# Altium project Bees.PrjPcb
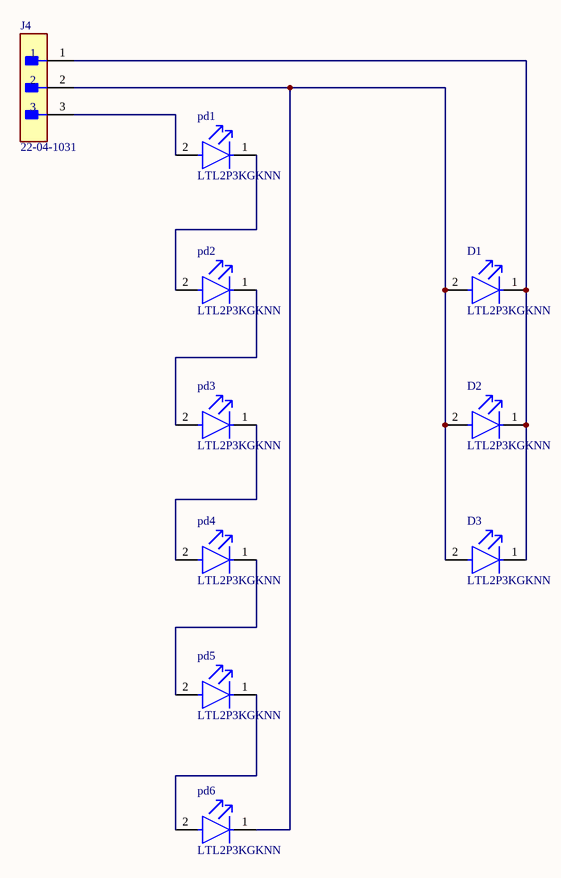
[diagram p0: ir.SchDoc]
3 sheets, 40 parts. Net scope: flat (ports and power ports of the same name join across sheets).
Board file: PCB2.PcbDoc
Sheets:
  ir.SchDoc
  atmega.SchDoc
  esp32.SchDoc

## Sheet ir.SchDoc
size A; SheetNumber: 1; SheetTotal: 2

### Parts
D1  LTL2P3KGKNN  [FP-LTL2P3KGKNN-MFG]
D2  LTL2P3KGKNN  [FP-LTL2P3KGKNN-MFG]
D3  LTL2P3KGKNN  [FP-LTL2P3KGKNN-MFG]
J4  22-04-1031  [FP-22-04-1031-MFG]
pd1  LTL2P3KGKNN  [FP-LTL2P3KGKNN-MFG]
pd2  LTL2P3KGKNN  [FP-LTL2P3KGKNN-MFG]
pd3  LTL2P3KGKNN  [FP-LTL2P3KGKNN-MFG]
pd4  LTL2P3KGKNN  [FP-LTL2P3KGKNN-MFG]
pd5  LTL2P3KGKNN  [FP-LTL2P3KGKNN-MFG]
pd6  LTL2P3KGKNN  [FP-LTL2P3KGKNN-MFG]

### Nets
NetD1_1: D1.1(C) D2.1(C) D3.1(C) J4.1
NetD1_2: D1.2(A) D2.2(A) D3.2(A) J4.2 pd6.1(C)
NetJ4_3: J4.3 pd1.2(A)
Netpd1_1: pd1.1(C) pd2.2(A)
Netpd2_1: pd2.1(C) pd3.2(A)
Netpd3_1: pd3.1(C) pd4.2(A)
Netpd4_1: pd4.1(C) pd5.2(A)
Netpd5_1: pd5.1(C) pd6.2(A)

### Library data of the parts
D1-D3 pd1-pd6 = CMP-22017-000002-1: LED GREEN CLEAR T-1 3/4 T/H; Manufacturer: Lite-On; Forward Voltage: 2.1V; Led Orientation: Straight; Forward Current: 20mA; Luminous Intensity: 980mcd; Wavelength: 572nm; Power Dissipation: 75mW; Peak Emmision Wavelength: 575nm; Viewing Angle: 22°; Reverse Voltage: 5V; Category: Diode; Temperature Range Low: -40°C; Device Class L1: Optoelectronics; Temperature: -40°C to +100°C; Mouser Description: LED Uni-Color Green 575nm 2-Pin T-1 3/4; Height: 9.95mm; Package: 0; Colour: Green; ComponentLink2Description: Datasheet; Digikey Description: LED GREEN CLEAR T-1 3/4 T/H; Automotive: No; Lead Free: Yes; ComponentLink2URL: https://optoelectronics.liteon.com/upload/download/DS20-2000-193/LTL2P3KGKNN.pdf; Manufacturer Part Number: LTL2P3KGKNN; Temperature Range High: +100°C; RoHS: TRUE; Device Class L2: LEDs; Device Class L3: unset; Octopart: https://octopart.com/ltl2p3kgknn-lite-on-550036
J4 = CMP-04776-000410-1: CONN HEADER VERT 3POS 2.5MM; Voltage Rating (AC): 250V; Number of Contacts: 3; Max Voltage Rating (DC): 250.25kV; Contact Resistance: 20mR; Hole Diameter: 1.19mm; Gender: Male; Connector Type: Male Pin; Insulation Resistance: 1GR; Glow Wire Compliant: Non-compliant; Current Rating: 3A; Contact Material: Brass; Series: KK; Number of Positions: 3; Contact Gender: Male; Mount: Through Hole; Working Voltage: 250V; Number of Poles: 3; Termination: Solder; Radiation Hardening: No; Lead Free: Lead Free; Min Operating Temperature: -40°C; Contact Mating Length: 0.295inch; Packaging: Bulk; Lead Pitch: 2.5mm; Voltage Rating: 250V; Voltage Rating (DC): 250V; Orientation: Straight; Color: Natural; Flammability Rating: UL94 V-0; Housing Material: Nylon; Pitch: 2.5mm; Contact Type: Male Pin; Number of Rows: 1; Housing Color: Natural; Max Operating Temperature: 105°C; Fastening Type: Friction; Halogen Free: Low Halogen; Contact Plating: Tin; Package Quantity: 1; Number of Circuits: 3

## Sheet atmega.SchDoc
size A; SheetNumber: 2; SheetTotal: 4
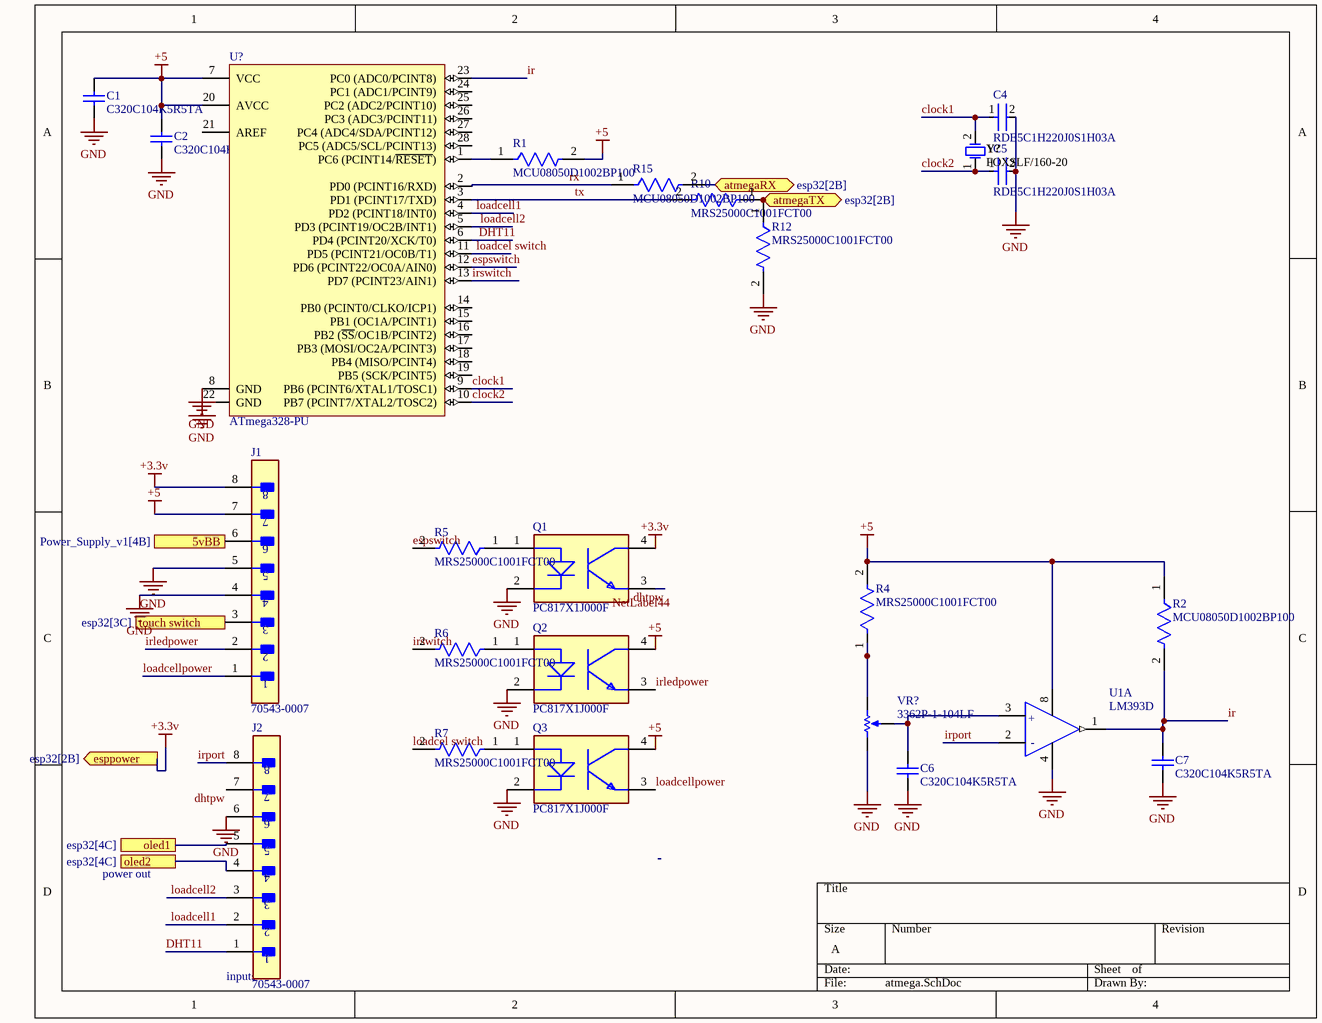
[diagram p1: atmega.SchDoc]

### Parts
C1  C320C104K5R5TA  [CAPR51-254-508X318X736]
C2  C320C104K5R5TA  [CAPR51-254-508X318X736]
C4  RDE5C1H220J0S1H03A  [FP-RDE0P1-MFG]
C5  RDE5C1H220J0S1H03A  [FP-RDE0P1-MFG]
C6  C320C104K5R5TA  [CAPR51-254-508X318X736]
C7  C320C104K5R5TA  [CAPR51-254-508X318X736]
J1  70543-0007  [FP-70543-0007-MFG]
J2  70543-0007  [FP-70543-0007-MFG]
Q1  PC817X1J000F  [FP-PC817X1J000F-MFG]
Q2  PC817X1J000F  [FP-PC817X1J000F-MFG]
Q3  PC817X1J000F  [FP-PC817X1J000F-MFG]
R1  MCU08050D1002BP100  [FP-MCU0805-IPC_C]
R2  MCU08050D1002BP100  [FP-MCU0805-IPC_C]
R4  MRS25000C1001FCT00  [FP-MRS25-MFG]
R5  MRS25000C1001FCT00  [FP-MRS25-MFG]
R6  MRS25000C1001FCT00  [FP-MRS25-MFG]
R7  MRS25000C1001FCT00  [FP-MRS25-MFG]
R10  MRS25000C1001FCT00  [FP-MRS25-MFG]
R12  MRS25000C1001FCT00  [FP-MRS25-MFG]
R15  MCU08050D1002BP100  [FP-MCU0805-IPC_C]
U1  LM393D  [FP-SO8-MFG]  (part A of 2)
U?  ATmega328-PU  [28P3]
VR?  3362P-1-104LF  [BOUR-3362P]
Y?  FOXSLF/160-20  [FOX-FOXSLF160-20]

### Ports
5vBB (see Power_Supply_v1[4B]), atmegaRX (bidir, see esp32[2B]), atmegaTX (bidir, see esp32[2B]), esppower (out, see esp32[2B]), oled1 (see esp32[4C]), oled2 (see esp32[4C]), touch switch (see esp32[3C])

### Nets
+3.3v: J1.8 Q1.4(C) ; port esppower
+5: C1.2 C2.2 J1.7 Q2.4(C) Q3.4(C) R1.2 R2.1 R4.2 U1.8(Vcc+) U?.7(VCC) U?.20(AVCC)
GND: C1.1 C2.1 C4.2 C5.2 C6.1 C7.1 J1.4 J1.5 J2.6 Q1.2(C) Q2.2(C) Q3.2(C) R12.2 U1.4(Vcc-) U?.8(GND) U?.22(GND) VR?.1(CCW)
clock1: C4.1 U?.9(PB6_(PCINT6/XTAL1/TOSC1)) Y?.2
clock2: C5.1 U?.10(PB7_(PCINT7/XTAL2/TOSC2)) Y?.1
DHT11: J2.1 U?.6(PD4_(PCINT20/XCK/T0))
dhtpw: J2.7 Q1.3(E)
espswitch: R5.2 U?.12(PD6_(PCINT22/OC0A/AIN0))
ir: C7.2 R2.2 U1.1(Out1) U?.23(PC0_(ADC0/PCINT8))
irledpower: J1.2 Q2.3(E)
irport: J2.8 U1.2(In1-)
irswitch: R6.2 U?.13(PD7_(PCINT23/AIN1))
loadcel switch: R7.2 U?.11(PD5_(PCINT21/OC0B/T1))
loadcell1: J2.2 U?.4(PD2_(PCINT18/INT0))
loadcell2: J2.3 U?.5(PD3_(PCINT19/OC2B/INT1))
loadcellpower: J1.1 Q3.3(E)
OLED SCL: J2.5 ; port oled1
OLED SDA: J2.4 ; port oled2
rx: R15.1 U?.2(PD0_(PCINT16/RXD))
tx: R10.2 U?.3(PD1_(PCINT17/TXD))
NetC6_2: C6.2 U1.3(In1+) VR?.2(S)
NetJ1_3: J1.3 ; port touch switch
NetJ1_6: J1.6 ; port 5vBB
NetMD?_34: R10.1 R12.1 ; port atmegaTX
NetMD?_35: R15.2 ; port atmegaRX
NetQ1_1: Q1.1(A) R5.1
NetQ2_1: Q2.1(A) R6.1
NetQ3_1: Q3.1(A) R7.1
NetR1_1: R1.1 U?.1(PC6_(PCINT14/~{RESET}))
NetR4_1: R4.1 VR?.3(CW)

Not connected (* = marked no-connect by the designer): U? 14(PB0_(PCINT0/CLKO/ICP1)) 15(PB1_(OC1A/PCINT1)) 16(PB2_(~{SS}/OC1B/PCINT2)) 17(PB3_(MOSI/OC2A/PCINT3)) 18(PB4_(MISO/PCINT4)) 19(PB5_(SCK/PCINT5)) 21(AREF) 24(PC1_(ADC1/PCINT9)) 25(PC2_(ADC2/PCINT10)) 26(PC3_(ADC3/PCINT11)) 27(PC4_(ADC4/SDA/PCINT12)) 28(PC5_(ADC5/SCL/PCINT13))

### Notes on the sheet
- power out
- (near J2) inputs
- Labels drawn without touching a wire or pin: NetLabel44
- (in symbol CMP-12132-000003-1, part A) +; -

### Library data of the parts
C1 C2 C6 C7 = CMP-1664-00004-1: Radial Leaded Multilayer Ceramic Capacitor, 0.1 uF, +/- 10%, 50 V, -55 to 125 degC, 2-Pin THD, RoHS, Tape and Reel; Case\Package: SOT-23-5; Max Power Dissipation: 250 mW; Output Current: 150 mA; Dropout Voltage: 260 mV; Outputs: 1; Output Voltage: 5 V; Max Input Voltage: 8 V; Min Operating Temperature: -40 degC; Packaging: Tape and Reel; Height: 1.3 mm; Radiation Hardening: No; Pins: 5; ComponentLink1Description: Manufacturer URL; Mount: Surface Mount; RoHSCompliant: true; Max Operating Temperature: 85 degC; PackageReference: CAPR51-254-508X318X736; ComponentLink2URL: http://www.kemet.com/docfinder?Partnumber=C320C104K5R5TA; PackageDescription: 2-Pin Through Hole Device, Body 5.08 x 3.18 mm, Pitch 2.54 mm; ComponentLink1URL: http://www.kemet.com/; Width: 1.8 mm; Package Quantity: 3000; DatasheetVersion: Dec-15; Length: 3 mm; ComponentLink2Description: Datasheet
C4 C5 = CMP-06035-010311-1: Ceramic Capacitor 22pF ±5% 50V C0G Radial; Lead Diameter: 0.5mm; Max Operating Temperature: 125°C; Lead Pitch: 0.098inch; Resistor Type: Ceramic; Case/Package: Radial; Package Quantity: 1; Capacitance: 22pF; Min Operating Temperature: -55°C; Dielectric: C0G; Height: 3.5mm; Voltage Rating (DC): 50V; Length: 0.197inch; Voltage Rating: 50V; Packaging: Tape and Reel; Height - Seated (Max): 0.236inch; Width: 0.098inch; Tolerance: 5%; Termination: Radial; Mount: Through Hole
J1 J2 = CMP-04776-000239-1: CONN HEADER VERT 8POS 2.54MM; Number of Circuits: 8; Gender: Male; Contact Resistance: 30mR; Current Rating: 3A; Glow Wire Compliant: Non-compliant; Approvals: UL; Voltage Rating: 250V; Body Material: Glass; Contact Plating: Gold; Mount: Through Hole; Lead Free: Lead Free; Packaging: Rail/Tube; Number of Positions: 8; Material: Brass; ELV: Compliant; Orientation: Vertical; Pitch: 2.54mm; Series: 70543; Package Quantity: 1104; RoHS Compliant: Yes; Housing Color: Black; Termination: Through Hole; Number of Contacts: 8; Min Operating Temperature: -40°C; Radiation Hardening: No; Max Operating Temperature: 105°C; Voltage Rating (DC): 250V; Flammability Rating: UL94 V-0; Number of Rows: 1; Housing Material: Thermoplastic; Contact Material: Bronze; Color: Black
Q1-Q3 = CMP-65434-000003-1: OPTOISOLATOR 5KV TRANS 4DIP; Collector Emitter Saturation Voltage: 200mV; Forward Voltage: 1.4V; Power Dissipation: 200mW; Input Current: 20mA; Max Collector Current: 50mA; Collector Emitter Breakdown Voltage: 80V; Rise Time: 18000ns; Number of Elements: 1; Reverse Breakdown Voltage: 6V; Current Transfer Ratio: 600%; Min Operating Temperature: -30°C; Number of Pins: 4; Radiation Hardening: No; Output Current per Channel: 50mA; Case/Package: DIP; Fall Time: 18000ns; Forward Current: 50mA; Isolation Voltage: 5kV; Package Quantity: 2000; Max Operating Temperature: 100°C; Packaging: Sleeve; Max Input Current: 50mA; Output Voltage: 80V; Max Power Dissipation: 200mW; Mount: Through Hole; Number of Channels: 1; Collector Emitter Voltage (VCEO): 80V
R1 R2 R15 = CMP-02407-010458-1: RES 1.05K OHM 0.5% 1/5W 0805; Power Rating: 125mW; Voltage Rating (DC): 100V; Tolerance: 0.1%; Resistance: 10kR; Temperature Coefficient: 25ppm/°C; Min Operating Temperature: -55°C; Military Standard: Not; Composition: Thin Film; Max Power Dissipation: 125mW; Lead Free: Lead Free; Case/Package: 0805; Contact Plating: Tin; Depth: 1.25mm; Number of Terminations: 2; Height: 0.022inch; Package Quantity: 1000; Max Operating Temperature: 125°C; Packaging: Tape and Reel; Mount: Surface Mount; Radiation Hardening: No; Length: 2mm; Width: 0.049inch
R4-R7 R10 R12 = CMP-02408-000051-1: RES 1K OHM 0.6W 1% AXIAL; Power Rating: 600mW; Lead Diameter: 0.6mm; Voltage Rating (DC): 350V; Resistance: 1kR; Temperature Coefficient: 50ppm/°C; Width: 2.5mm; Military Standard: Not; Package Quantity: 5000; Radiation Hardening: No; Case/Package: Axial; Resistance Tolerance: 1%; Resistor Type: Metal Film; Contact Plating: Tin; Length: 6.5mm; Lead Free: Lead Free; RoHS Compliant: Yes; Mount: Through Hole; Number of Pins: 2; Technology: THIN FILM; Voltage Rating: 350V; Min Operating Temperature: -55°C; Weight: 0.00776oz; Diameter: 2.5mm; Construction: Cylindrical; Series: MRS25; Tolerance: 1%; Packaging: Tape and Reel; Max Operating Temperature: 155°C; Max Power Dissipation: 600mW; Number of Terminations: 2; Termination: Axial
U1 = CMP-12132-000003-1: IC VOLT COMPARATOR DUAL LP 8SOIC; Manufacturer: STMicroelectronics; Response Time: 1.3us; Min Supply Voltage: 2V; Input Offset Voltage: 1mV; Input Bias Current: 0.02uA; Max Dual Supply Voltage: 18V; Output Current Per Channel: 18mA; Max Junction Temp: +150°C; Standoff Height: 0.1mm; Number Of Channels: 2; Nominal Supply Current: 0.45-0.6mA; Voltage Gain: 200V/mV; Max Supply Voltage: 36V; Min Dual Supply Voltage: 1V; Ambient Temperature Range Low: 0°C; ComponentLink2Description: Datasheet; Lead Free: Yes; Device Class L3: Comparators; Device Class L2: Linear ICs; Manufacturer Part Number: LM393D; Digikey Description: IC VOLT COMPARATOR DUAL LP 8SOIC; Category: IC; Octopart: https://octopart.com/lm393d-stmicroelectronics-25832; Package: SO8; RoHS: TRUE; Footprint Url: https://www.st.com/resource/en/datasheet/stm8l001j3.pdf; Temperature Range Low: 0°C; Temperature Range High: +70°C; Mouser Description: Analog Comparators Lo-Pwr Dual Voltage; ComponentLink2URL: https://www.st.com/resource/en/datasheet/lm393.pdf; Automotive: No; Temperature: 0°C to +70°C; Height: 1.75mm; Device Class L1: Integrated Circuits (ICs); Ambient Temperature Range High: +70°C
U? = CMP-0095-00015-2: 8-bit AVR Microcontroller, 32KB Flash, 1KB EEPROM, 2KB SRAM, 28-pin PDIP, Industrial Grade (-40°C to 85°C); ComponentLink3Description: ATmega48A/48PA/88A/88PA/168A/168PA/328/328P Summary; RevisionNote: DatasheetVersion updated. URLs added.; DatasheetVersion: revD, May-2011; ComponentLink1URL: http://www.atmel.com/; PackageVersion: revB, Sep-2001; PackageDescription: 28-lead (0.300"/7.62mm Wide) Plastic Dual Inline Package (PDIP); PackageReference: 28P3; ComponentLink1Description: Manufacturer URL; ComponentLink2Description: ATmega48A/48PA/88A/88PA/168A/168PA/328/328P Datasheet; ComponentLink3URL: http://www.atmel.com/dyn/resources/prod_documents/8271S.pdf; ComponentLink2URL: http://www.atmel.com/dyn/resources/prod_documents/8271.pdf
VR? = CMP-1747-00003-1: Square Trimpot(R) Trimming Potentiometer, 100 KOhm, 300 V, -55 to 125 degC, 3-Pin THD, RoHS, Tube; Voltage Rating: 250 V; Case\Package: Axial; Tolerance: 1%; Power Rating: 250 mW; Resistance: 1 mohm; RoHSCompliant: true; ComponentLink2URL: http://www.bourns.com/docs/Product-Datasheets/3362.pdf; ComponentLink1Description: Manufacturer URL; DatasheetVersion: May-16; Package Quantity: 200; ComponentLink2Description: Datasheet; Min Operating Temperature: -55 degC; Mount: Through Hole; PackageDescription: 3-Pin Through Hole Device, Body 6.6 x 6.99 mm, Pitch 2.54 mm; Length: 0.248 inch; ComponentLink1URL: http://www.bourns.com/; PackageReference: 3326P; Max Operating Temperature: 155 degC; Packaging: Bulk
Y? = CMP-1749-00003-1: Resistance Weld Thru-Hole Crystal, 16 MHz, -20 to 70 degC, 2-Pin THD, RoHS, Bulk; Voltage Rating: 250 V; Tolerance: 1%; Resistance: 221 kohm; Case\Package: Axial; Power Rating: 250 mW; RoHSCompliant: true; Package Quantity: 200; Packaging: Bulk; Min Operating Temperature: -55 degC; DatasheetVersion: Mar-15; ComponentLink1URL: http://www.foxonline.com/; Max Operating Temperature: 155 degC; PackageReference: FOXSLF160-20; Mount: Through Hole; PackageDescription: 2-Pin Through Hole Device, Body 11.35 x 4.65 mm; ComponentLink1Description: Manufacturer URL; ComponentLink2URL: http://www.foxonline.com/pdfs/hc49slf.pdf; ComponentLink2Description: Datasheet; Length: 0.248 inch

## Sheet esp32.SchDoc
size A; SheetNumber: 3; SheetTotal: 4
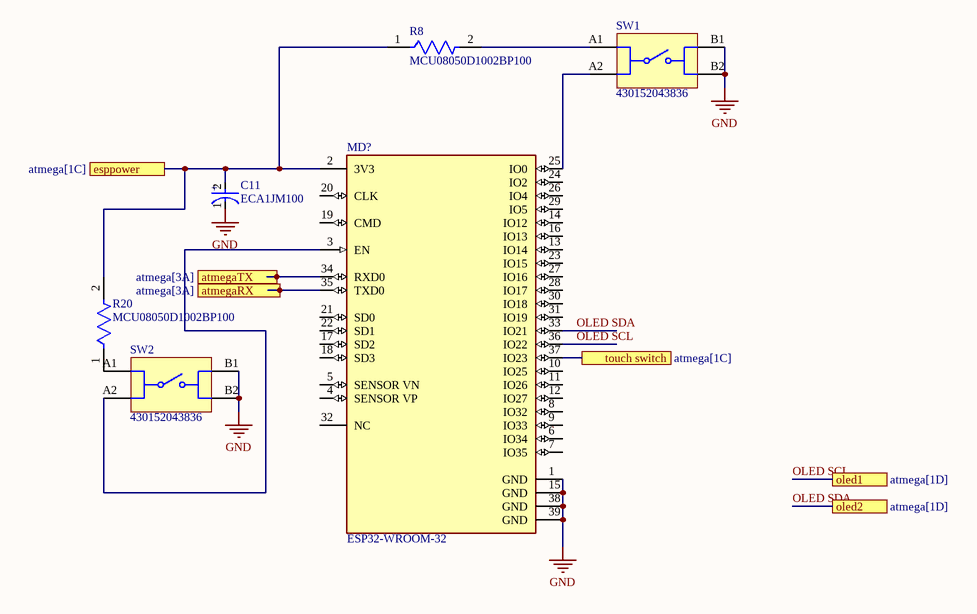
[diagram p2: esp32.SchDoc]

### Parts
C11  ECA1JM100  [FP-RAD-TH-D_5_0_5-L_11_1-MFG]
MD?  ESP32-WROOM-32  [FP-ESP32-WROOM-32-MFG]
R8  MCU08050D1002BP100  [FP-MCU0805-IPC_C]
R20  MCU08050D1002BP100  [FP-MCU0805-IPC_C]
SW1  430152043836  [WS-TASV_L6W6H4.3_4301x20438x6]
SW2  430152043836  [WS-TASV_L6W6H4.3_4301x20438x6]

### Ports
atmegaRX (see atmega[3A]), atmegaTX (see atmega[3A]), esppower (see atmega[1C]), oled1 (see atmega[1D]), oled2 (see atmega[1D]), touch switch (see atmega[1C])

### Nets
+3.3v: C11.2(A) MD?.2(3V3) R8.1 R20.2 ; port esppower
GND: C11.1(C) MD?.1(GND) MD?.15(GND) MD?.38(GND) MD?.39(GND) SW1.B1 SW1.B2 SW2.B1 SW2.B2
OLED SCL: MD?.36(IO22) ; port oled1
OLED SDA: MD?.33(IO21) ; port oled2
NetJ1_3: MD?.37(IO23) ; port touch switch
NetMD?_3: MD?.3(EN) SW2.A2
NetMD?_25: MD?.25(IO0) SW1.A2
NetMD?_34: MD?.34(RXD0) ; port atmegaTX
NetMD?_35: MD?.35(TXD0) ; port atmegaRX
NetR8_2: R8.2 SW1.A1
NetR20_1: R20.1 SW2.A1

Not connected (* = marked no-connect by the designer): MD? 4(SENSOR_VP) 5(SENSOR_VN) 6(IO34) 7(IO35) 8(IO32) 9(IO33) 10(IO25) 11(IO26) 12(IO27) 13(IO14) 14(IO12) 16(IO13) 17(SD2) 18(SD3) 19(CMD) 20(CLK) 21(SD0) 22(SD1) 23(IO15) 24(IO2) 26(IO4) 27(IO16) 28(IO17) 29(IO5) 30(IO18) 31(IO19) 32(NC)

### Notes on the sheet
- (in symbol CMP-05427-001517-1) +

### Library data of the parts
C11 = CMP-05427-001517-1: Aluminum Electrolytic Capacitors (Radial Lead Type) 10uF ±20% 63V; Life (Hours): 2000Hour; Dielectric Material: Aluminium; Lead/Base Style: Straight; Ripple Current: 70mA; Dissipation Factor: 0.11%; Leakage Current: 3uA; Lead Diameter: 0.5mm; Max Operating Temperature: 85°C; Capacitance: 10uF; Voltage Rating: 63V; Packaging: Bulk; Radiation Hardening: No; Tolerance: 20%; Height: 11mm; Mount: Through Hole; Voltage: 63V; Voltage Rating (DC): 63V; Lead Pitch: 2mm; RoHS Compliant: Yes; Diameter: 5mm; Package Quantity: 200; Length: 11mm; Case/Package: Radial; Min Operating Temperature: -40°C; Construction: RADIAL; Height - Seated (Max): 0.472inch; Lead Free: Lead Free; Termination: Radial; Width: 5mm; Series: M; REACH SVHC: No SVHC
MD? = CMP-194065-000008-1: RX TXRX MOD WIFI SURFACE MOUNT; Frequency: 2.5GHz; Sensitivity: -98dBm; Operating Supply Voltage: 3.6V; Data Rate: 150Mbps; Weight: 0.088185oz; Package Quantity: 550; Min Operating Temperature: -40°C; Mount: Surface Mount; Max Operating Temperature: 85°C; Packaging: Cut Tape; Case/Package: SMD/SMT
R8 R20 = CMP-02407-010458-1: as R1 on sheet atmega; Min Operating Temperature: -55°C; Military Standard: Not; Composition: Thin Film; Max Power Dissipation: 125mW; Lead Free: Lead Free; Case/Package: 0805; Contact Plating: Tin; Depth: 1.25mm; Number of Terminations: 2; Height: 0.022inch; Package Quantity: 1000; Max Operating Temperature: 125°C; Packaging: Tape and Reel; Mount: Surface Mount; Radiation Hardening: No; Length: 2mm; Width: 0.049inch
SW1 SW2 = CMP-1452-00002-2: NexarPartId: 22861785; Voltage Rating: 12V; Current Rating: 50mA; Switch Travel: 250µm; Switch Function: Off-Mom; Actuator Material: Liquid Crystal Polymer, Polymer; Insulation Resistance: 100MΩ; Actuator Length: 900µm; Throw Configuration: SPST; Mechanical Life: 200kcycles; Illumination Type: Illuminated, Non-Illuminated; Mount: Surface Mount; Max Operating Temperature: 85°C; Height: 4.3mm; RoHS: Compliant; Length: 6.2mm; Color: Orange; Width: 6.2mm; Contact Current Rating: 50mA; Diameter: 3.5mm; Termination: Gull Wing; Packaging: Tape and Reel; REACH SVHC: No SVHC; Contact Plating: Silver; Min Operating Temperature: -40°C; Contact Material: Stainless Steel, Steel

## Nets that join several sheets
+3.3v: atmega (J1.8 Q1.4), esp32 (C11.2 MD?.2 R8.1 R20.2)
GND: atmega (17 pins), esp32 (9 pins)
NetJ1_3: atmega (J1.3), esp32 (MD?.37)
NetMD?_34: atmega (R10.1 R12.1), esp32 (MD?.34)
NetMD?_35: atmega (R15.2), esp32 (MD?.35)
OLED SCL: atmega (J2.5), esp32 (MD?.36)
OLED SDA: atmega (J2.4), esp32 (MD?.33)